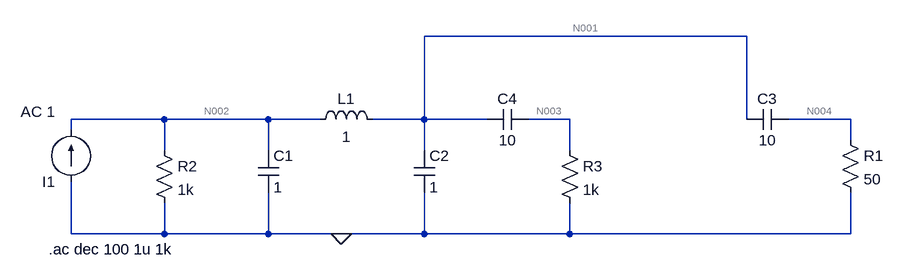
[diagram p0: schematic Draft4.asc]
Draft4.asc, the LTspice schematic file:
Version 4
SHEET 1 1032 680
WIRE 816 -32 320 -32
WIRE -80 96 -224 96
WIRE 80 96 -80 96
WIRE 160 96 80 96
WIRE 320 96 320 -32
WIRE 320 96 240 96
WIRE 416 96 320 96
WIRE 544 96 480 96
WIRE 816 96 816 -32
WIRE 976 96 880 96
WIRE -224 112 -224 96
WIRE 976 128 976 96
WIRE -80 144 -80 96
WIRE 80 144 80 96
WIRE 320 144 320 96
WIRE 544 144 544 96
WIRE -224 272 -224 192
WIRE -80 272 -80 224
WIRE -80 272 -224 272
WIRE 80 272 80 208
WIRE 80 272 -80 272
WIRE 192 272 80 272
WIRE 320 272 320 208
WIRE 320 272 192 272
WIRE 544 272 544 224
WIRE 544 272 320 272
WIRE 976 272 976 208
WIRE 976 272 544 272
FLAG 192 272 0
SYMBOL ind 144 112 R270
WINDOW 0 32 56 VTop 2
WINDOW 3 5 56 VBottom 2
SYMATTR InstName L1
SYMATTR Value 1
SYMBOL cap 64 144 R0
SYMATTR InstName C1
SYMATTR Value 1
SYMBOL cap 304 144 R0
SYMATTR InstName C2
SYMATTR Value 1
SYMBOL cap 880 80 R90
WINDOW 0 0 32 VBottom 2
WINDOW 3 32 32 VTop 2
SYMATTR InstName C3
SYMATTR Value 10
SYMBOL res 960 112 R0
SYMATTR InstName R1
SYMATTR Value 50
SYMBOL current -224 192 R180
WINDOW 123 24 108 Left 2
WINDOW 39 0 0 Left 0
SYMATTR InstName I1
SYMATTR Value ""
SYMATTR Value2 AC 1
SYMBOL res -96 128 R0
SYMATTR InstName R2
SYMATTR Value 1k
SYMBOL cap 480 80 R90
WINDOW 0 0 32 VBottom 2
WINDOW 3 32 32 VTop 2
SYMATTR InstName C4
SYMATTR Value 10
SYMBOL res 528 128 R0
SYMATTR InstName R3
SYMATTR Value 1k
TEXT -258 296 Left 2 !.ac dec 100 1u 1k

The netlist it stands for:
* Draft4.asc
L1 N002 N001 1
C1 N002 0 1
C2 N001 0 1
C3 N004 N001 10
R1 N004 0 50
I1 0 N002 AC 1
R2 N002 0 1k
C4 N003 N001 10
R3 N003 0 1k
.ac dec 100 1u 1k
.backanno
.end

* Results of the author's LTspice run, read from the files saved beside the schematic
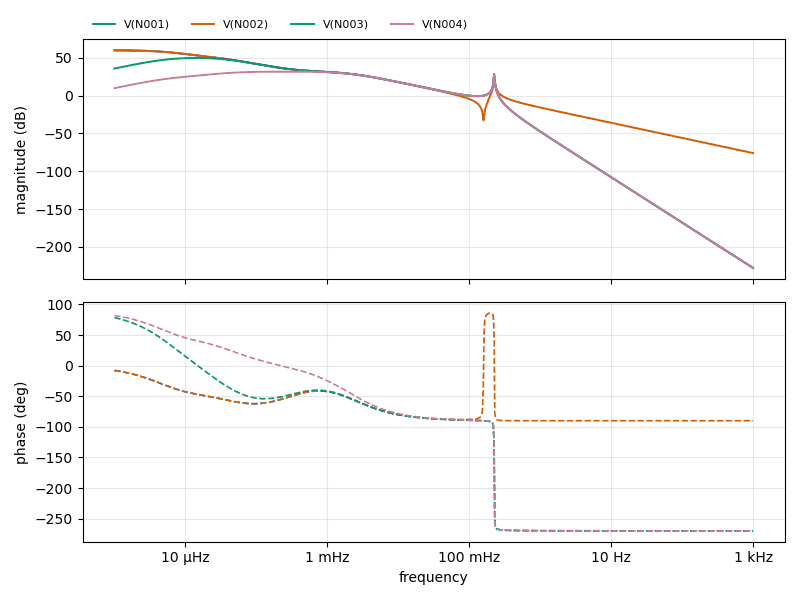
[diagram p1: AC Analysis of Draft4.asc, plotted from the saved traces]
* AC Analysis, 1 run:
*   V(N001): 59.88 dB at 1 µHz, -227.89 dB at 1 kHz, peak 59.88 dB at 1 µHz, 3 dB below the peak at 6.583 µHz
*   V(N002): 59.88 dB at 1 µHz, -75.96 dB at 1 kHz, peak 59.88 dB at 1 µHz, 3 dB below the peak at 6.583 µHz
*   V(N003): 35.83 dB at 1 µHz, -227.89 dB at 1 kHz, peak 49.79 dB at 14.13 µHz, 3 dB below the peak at 4.428 µHz and 45.23 µHz
*   V(N004): 9.83 dB at 1 µHz, -227.89 dB at 1 kHz, peak 31.67 dB at 251.2 µHz, 3 dB below the peak at 26.62 µHz and 2.106 mHz